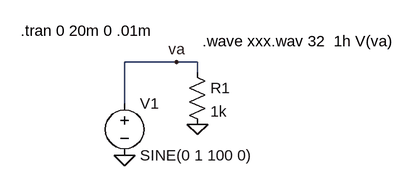
[diagram p0: schematic Draft3.asc]
Draft3.asc, the LTspice schematic file:
Version 4
SHEET 1 880 680
WIRE 224 80 144 80
WIRE 256 80 224 80
WIRE 256 96 256 80
WIRE 144 144 144 80
FLAG 144 224 0
FLAG 256 176 0
FLAG 224 80 va
SYMBOL voltage 144 128 R0
WINDOW 123 0 0 Left 2
WINDOW 39 0 0 Left 2
SYMATTR InstName V1
SYMATTR Value SINE(0 1 100 0)
SYMBOL res 240 80 R0
SYMATTR InstName R1
SYMATTR Value 1k
TEXT 264 48 Left 2 !.wave xxx.wav 32  1h V(va)
TEXT -16 32 Left 2 !.tran 0 20m 0 .01m

The netlist it stands for:
* Draft3.asc
V1 va 0 SINE(0 1 100 0)
R1 va 0 1k
.wave xxx.wav 32  1h V(va)
.tran 0 20m 0 .01m
.backanno
.end